# EAGLE design rotary-launcher (EAGLE 7.4.0)
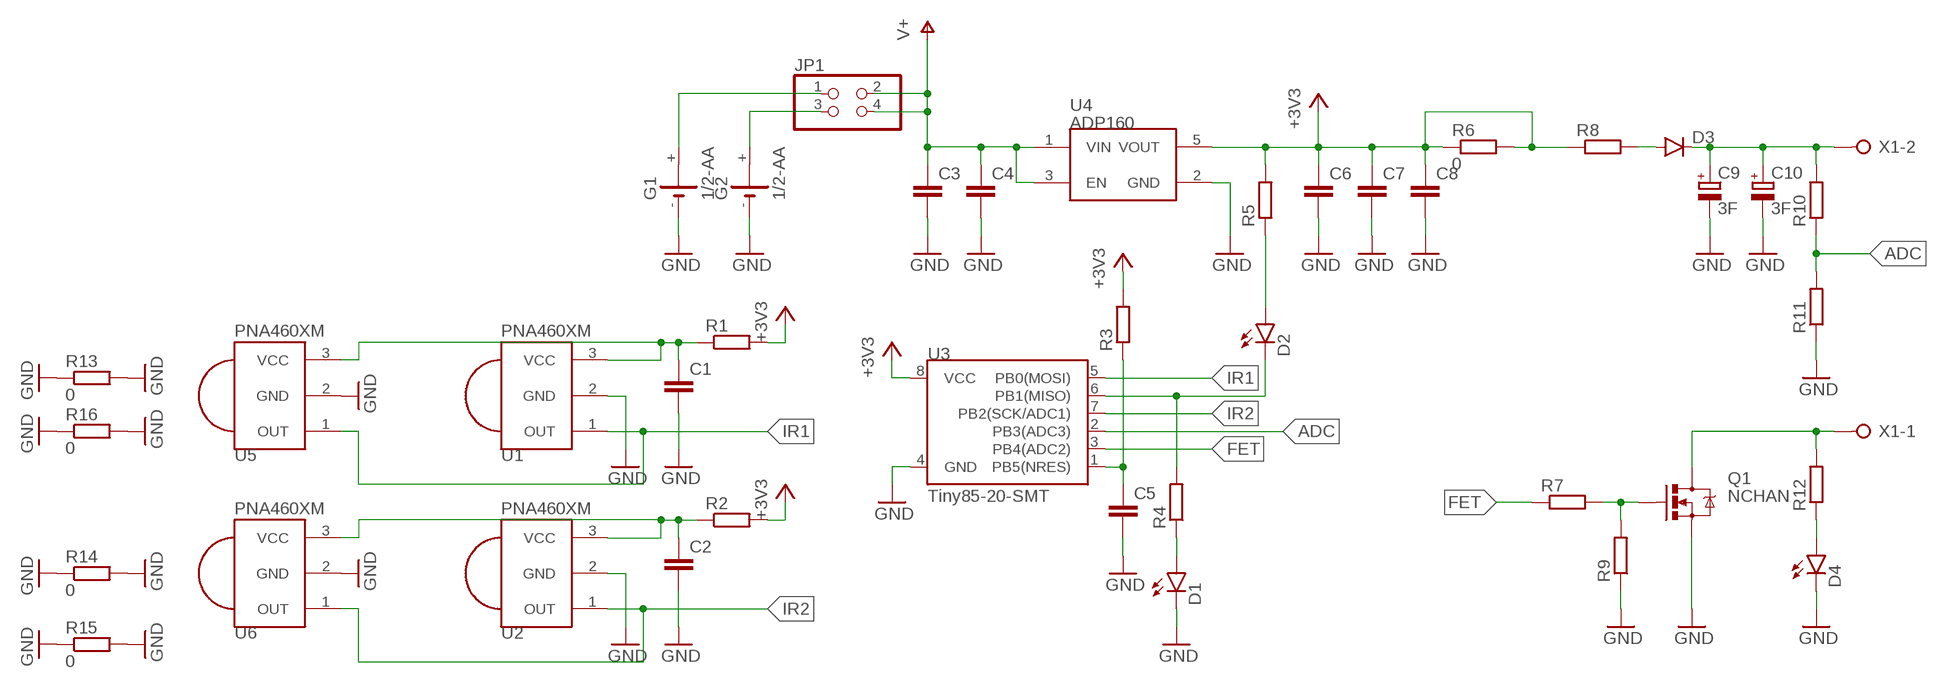
[diagram p0: schematic, sheet 1]

## Parts
C1  C-EUC0805  [C0805]
C2  C-EUC0805  [C0805]
C3  C-EUC0805  [C0805]
C4  C-EUC0805  [C0805]
C5  C-EUC0805  [C0805]
C6  C-EUC0805  [C0805]
C7  C-EUC0805  [C0805]
C8  C-EUC0805  [C0805]
C9  3F  SUPERCAPH  [E3,5-8-HOR]
C10  3F  SUPERCAPH  [E3,5-8-HOR]
D1  LED0603  [LED-0603]
D2  LED0603  [LED-0603]
D3  DIODESMB  [SMB-DIODE]
D4  LED0603  [LED-0603]
G1  1/2-AA  CR-AA  [CRAA]
G2  1/2-AA  CR-AA  [CRAA]
JP1  PINHD-2X2  [2X02]
Q1  NCHAN  MOSFET-NCHANNELAO3404A  [SOT23-3]
R1  R-EU_R0603  [R0603]
R2  R-EU_R0603  [R0603]
R3  R-EU_R0603  [R0603]
R4  R-EU_R0603  [R0603]
R5  R-EU_R0603  [R0603]
R6  0  R-EU_R1206  [R1206]
R7  R-EU_R0603  [R0603]
R8  R-EU_R1206  [R1206]
R9  R-EU_R0603  [R0603]
R10  R-EU_R0603  [R0603]
R11  R-EU_R0603  [R0603]
R12  R-EU_R0603  [R0603]
R13  0  R-EU_R1206  [R1206]
R14  0  R-EU_R1206  [R1206]
R15  0  R-EU_R1206  [R1206]
R16  0  R-EU_R1206  [R1206]
U1  PNA460XM  [PNA460XM]
U2  PNA460XM  [PNA460XM]
U3  Tiny85-20-SMT  ATTINY45TINY85-20-SMT  [SO08-EIAJ]
U4  ADP160  [SOT23-5]
U5  PNA460XM  [PNA460XM]
U6  PNA460XM  [PNA460XM]
X1  W237-02P  [W237-132]

## Nets
+3V3: C6.1 C7.1 C8.1 R1.2 R2.2 R3.2 R5.2 R6.1 R6.2 R8.1 U3.8(VCC) U4.5(VOUT)
ADC: R10.1 R11.2 U3.2(PB3(ADC3))
FET: R7.1 U3.3(PB4(ADC2))
GND: C1.2 C2.2 C3.2 C4.2 C5.2 C6.2 C7.2 C8.2 C9.- C10.- D1.C D4.C G1.- G2.- Q1.2(S) R9.1 R11.1 R13.1 R13.2 R14.1 R14.2 R15.1 R15.2 R16.1 R16.2 U1.2(GND) U2.2(GND) U3.4(GND) U4.2(GND) U5.2(GND) U6.2(GND)
IR1: U1.1(OUT) U3.5(PB0(MOSI)) U5.1(OUT)
IR2: U2.1(OUT) U3.7(PB2(SCK/ADC1)) U6.1(OUT)
N$1: D3.A R8.2
N$2: C9.+ C10.+ D3.C R10.2 X1.2
N$3: G1.+ JP1.1
N$4: G2.+ JP1.3
N$5: C1.1 R1.1 U1.3(VCC) U5.3(VCC)
N$6: Q1.1(G) R7.2 R9.2
N$7: C2.1 R2.1 U2.3(VCC) U6.3(VCC)
N$8: C5.1 R3.1 U3.1(PB5(NRES))
N$9: Q1.3(D) R12.2 X1.1
N$10: D4.A R12.1
N$11: D2.C R4.2 U3.6(PB1(MISO))
N$12: D2.A R5.1
N$15: D1.A R4.1
V+: C3.1 C4.1 JP1.2 JP1.4 U4.1(VIN) U4.3(EN)

## Library data of the parts
C1-C8 = rcl:C-EU: CAPACITOR, European symbol
C9 C10 = rotary-launcher:SUPERCAP
D1 D2 D4 = SparkFun-LED:LED: LEDs Standard schematic elements and footprints for 5mm, 3mm, 1206, and 0603 sized LEDs. 5mm - Spark Fun Electronics SKU : COM-00529 (and others)
D3 = SparkFun-DiscreteSemi:DIODE: Diode These are standard reverse protection diodes and small signal diodes. SMA package can handle up to about 1A. SOD-323 can handle about 200mA. What the SOD-323 package when ordering, there are some mfgs out there that are 5-pin packages.; PROD_ID: DIO-09646
G1 G2 = rotary-launcher:CR-AA: LI BATTERY Varta CRAA-SLF
JP1 = pinhead:PINHD-2X2: PIN HEADER
Q1 = SparkFun-DiscreteSemi:MOSFET-NCHANNEL: Common NMOSFET Parts MFG P/N Store ID Prod ID FDD8780 TRANS-09984 SI7820DN TRANS-11055 FDS6630A IC-08089 2N7002PW TRANS-11151 FQP30N06L COM-10213 TRANS-10060 BSS123LT1G TRANS-08345 BSS138 TRANS-00830 BS170 2N7000; PROD_ID: TRAN-12988
R1-R16 = rcl:R-EU_: RESISTOR, European symbol
U1 U2 U5 U6 = rotary-launcher:PNA460XM: IR 38KHz receiver PNA4602 and related receivers http://www.ladyada.net/library/pcb/eaglelibrary.html
U3 = SparkFun-DigitalIC:ATTINY45: Atmel 8-pin 2/4/8kB flash uC; PROD_ID: IC-09092
U4 = SparkFun-PowerIC:ADP160: Nanopower LDO Iq less than 1uA for low Iload; PROD_ID: VREG-11306
X1 = con-wago-508:W237-02P: WAGO SREW CLAMP; OC_FARNELL: unknown; OC_NEWARK: unknown

## Board
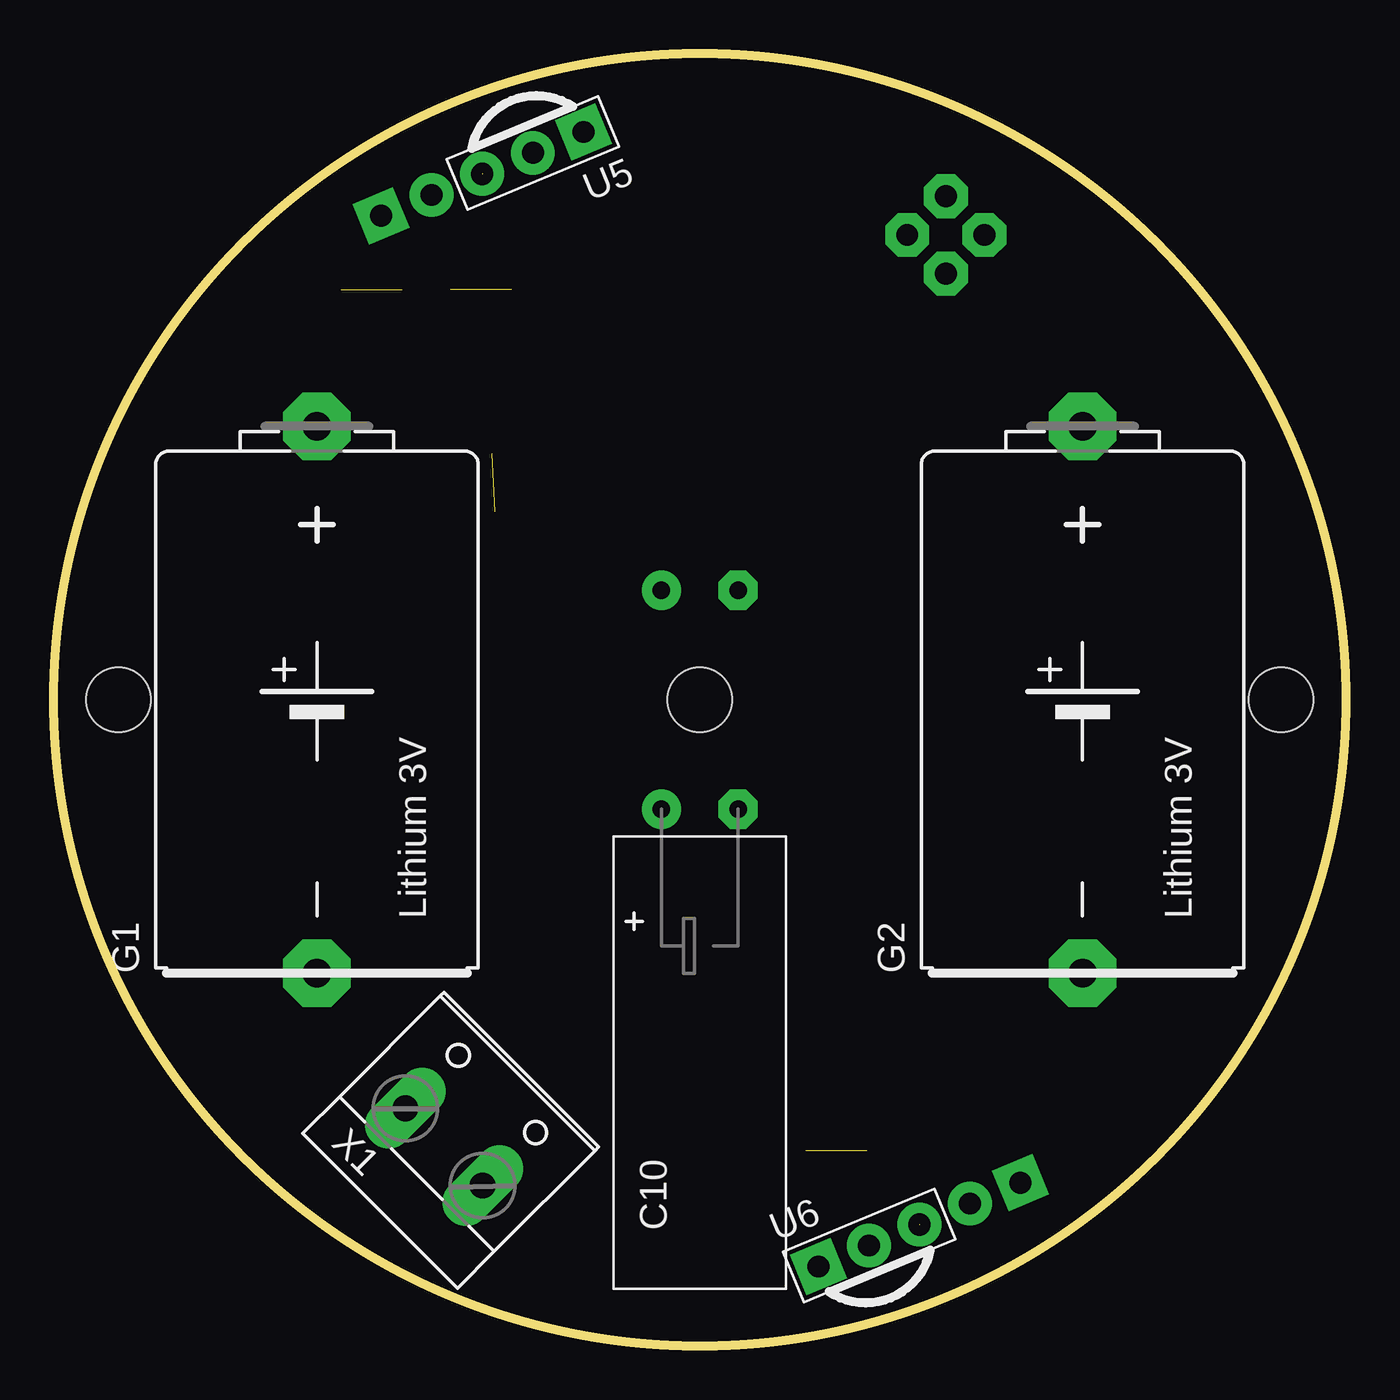
[diagram p1: board, top side]
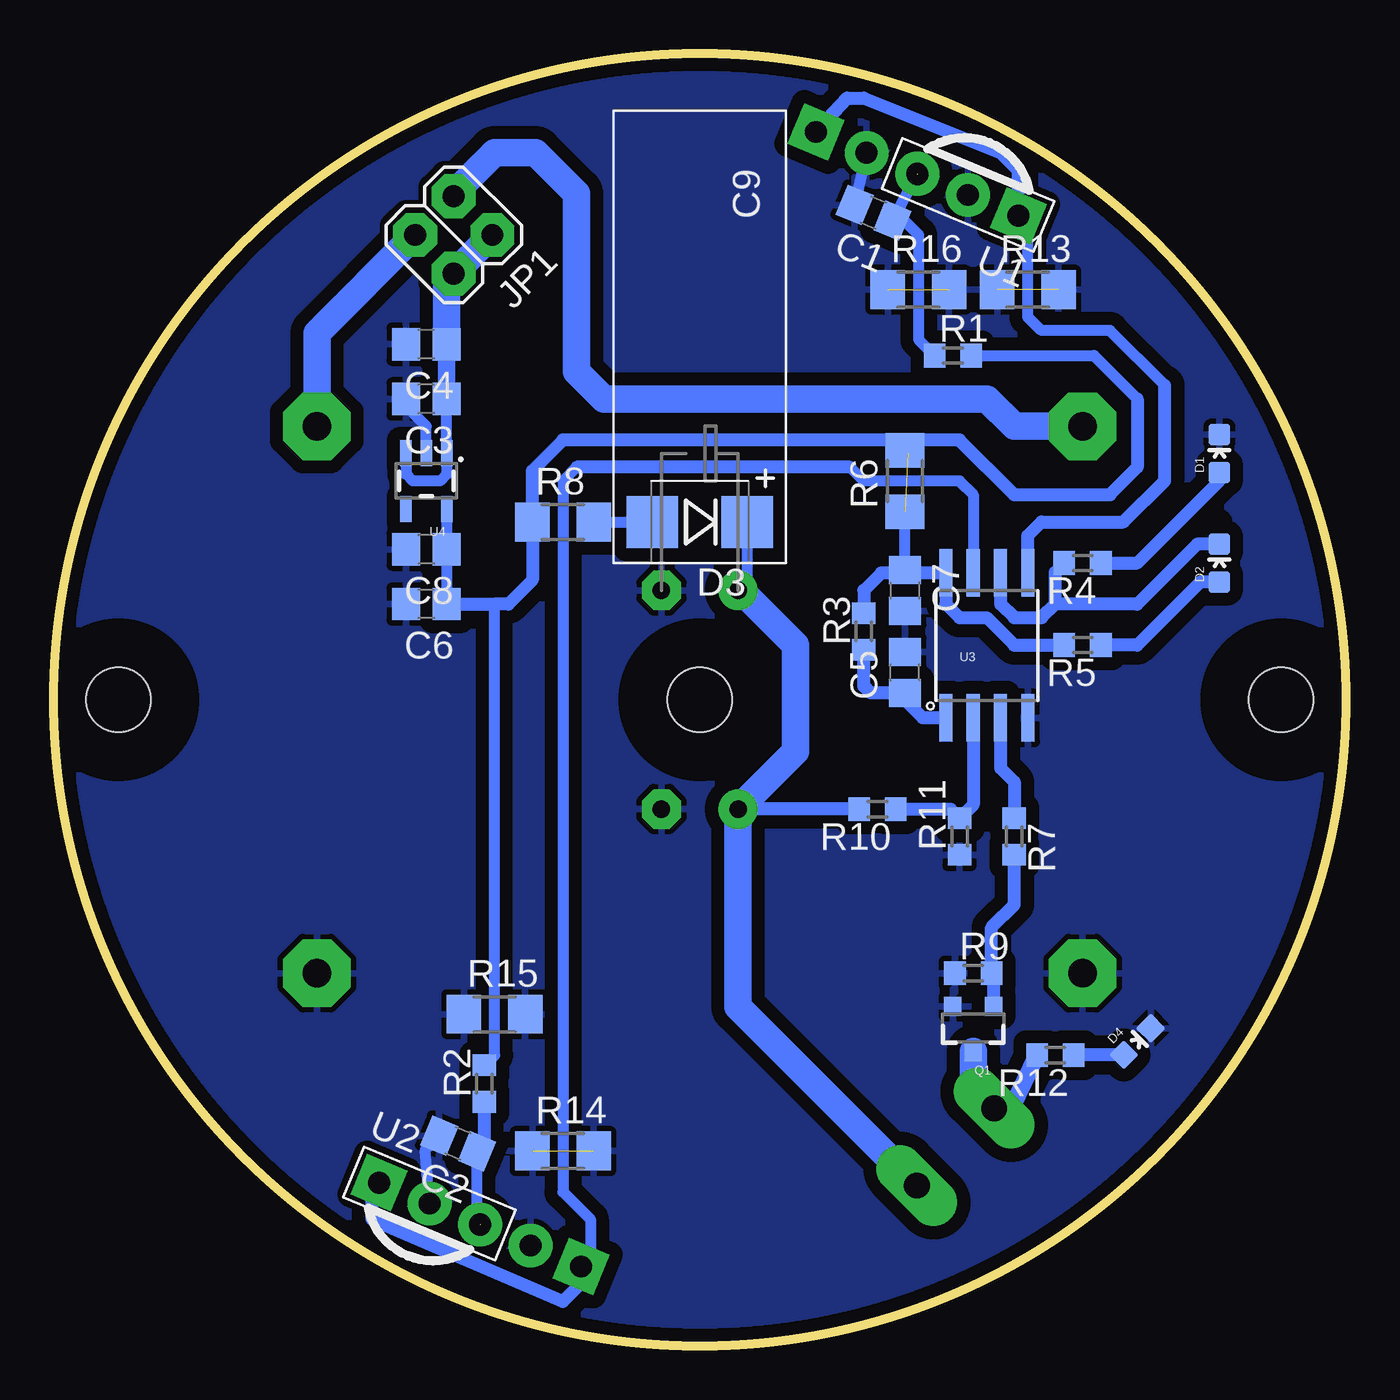
[diagram p2: board, bottom side, seen from below]

Size 60 x 60 mm. Coordinates in mm from the lower left corner, seen from the top.
Outline: circle at 30,30 radius 30
Copper layers (1*16): Top 0.035mm / dielectric 1.5mm / Bottom 0.035mm
Design rules "default *": minimum track width 10mil, minimum drill 24mil, track to track 8mil, track to pad 8mil, pad to pad 8mil, via to via 8mil, smd to smd 8mil, copper to edge 20mil, drill to drill 8mil, minimum pad ring 20mil, minimum via ring 8mil, stop-mask expansion 4mil, vias tented up to drill 0mil, thermal gap 10mil
Holes 3 mm at 57,30 3,30 30,30
bRestrict: area 27,27 to 33,33; area 28.7,37 to 31.3,37.6; area 54,27 to 60,33; area 0,27 to 6,33; area 5.9,36.4 to 6.5,38.3

### Footprints (pad centres in the part's own frame; a part is rotated, then mirrored left to right if it is on the bottom)
C0805 = smd 1.3 x 1.5: 1 -0.95,0; 2 0.95,0
E3,5-8-HOR = drill 0.813 pad 1.6: + -1.778,0 | drill 0.813 pad 1.6 octagon: - 1.778,0
LED-0603 = smd 1 x 1: A 0,-0.877; C 0,0.877
SMB-DIODE = smd 2.4 x 2.4: A 2.2,0; C -2.2,0
CRAA = drill 1.321 pad 3.15 octagon: + 12.7,0; - -12.7,0
2X02 = drill 1.016 octagon: 1 -1.27,-1.27; 2 -1.27,1.27; 3 1.27,-1.27; 4 1.27,1.27
SOT23-3 = smd 0.8 x 0.9: 1 -0.95,-1; 2 0.95,-1; 3 0,1.1
R0603 = smd 1 x 1.1: 1 -0.85,0; 2 0.85,0
R1206 = smd 1.6 x 1.803: 1 -1.422,0; 2 1.422,0
PNA460XM = drill 1.016 pad 1.93 square: 1 -2.54,0 | drill 1.016 pad 1.93: 2 0,0; 3 2.54,0
SO08-EIAJ = smd 0.61 x 2.21: 1 -1.905,-3.378; 2 -0.635,-3.378; 3 0.635,-3.378; 4 1.905,-3.378; 5 1.905,3.353; 6 0.635,3.353; 7 -0.635,3.353; 8 -1.905,3.353
SOT23-5 = smd 0.55 x 1.2: 1 -0.95,-1.3; 2 0,-1.3; 3 0.95,-1.3; 4 0.95,1.3; 5 -0.95,1.3
W237-132 = drill 1.194 long: 1 -2.54,-0.635; 2 2.54,-0.635

### Placement (x,y rotation side)
C1  21.93,52.62 157.5 bottom
C2  41.22,9.39 157.5 bottom
C3  42.7,43.97 180 bottom
C4  42.7,46.51 180 bottom
C5  20.48,31.27 90 bottom
C6  42.7,34.45 180 bottom
C7  20.48,35.08 270 bottom
C8  42.7,36.98 180 bottom
C9  30,35.08 180 bottom
C10  30,24.92 0 top
D1  5.87,41.43 0 bottom
D2  5.87,36.35 0 bottom
D3  30,38.26 180 bottom
D4  9.68,14.12 315 bottom
G1  12.22,30 90 top
G2  47.78,30 90 top
JP1  41.43,51.59 225 bottom
Q1  17.3,14.76 180 bottom
R1  18.24,45.98 0 bottom
R2  40.01,12.17 90 bottom
R3  22.38,33.17 90 bottom
R4  12.22,36.35 180 bottom
R5  12.22,32.54 180 bottom
R6  20.48,40.16 90 bottom
R7  15.39,23.65 270 bottom
R8  36.35,38.26 0 bottom
R9  17.3,17.3 0 bottom
R10  21.74,24.92 180 bottom
R11  17.94,23.65 90 bottom
R12  13.49,13.49 180 bottom
R13  14.76,49.05 0 bottom
R14  36.35,9.05 0 bottom
R15  39.52,15.39 0 bottom
R16  19.84,49.05 0 bottom
U1  17.54,53.45 157.5 bottom
U2  42.55,6.6 337.5 bottom
U3  16.66,32.54 0 bottom
U4  42.7,40.16 180 bottom
U5  22.25,55.4 202.5 top
U6  37.86,4.65 22.5 top
X1  18.57,9.68 315 top

### Tracks (layer width: path | path; a pad name or v marks a point on that pad's centre or on a via)
+3V3  (1 unrouted)
  Bottom 0.5: 20.44,35.89 C7.1 R6.1 | U4.5 C8.1 C6.1 | 9.68,43.97 11.69,45.98 R1.2 | R2.2 39.99,13.02 39.52,13.49 39.52,34.45 | 20.32,41.43 R6.2
  Bottom 0.61: C6.1 39.52,34.45 38.89,34.45 37.77,35.56 R8.1 37.77,40.64 36.35,42.06 20.96,42.06 R6.2 19.99,42.06 17.94,42.06 15.39,39.52 10.95,39.52 9.68,40.8 9.68,43.97 | R5.2 15.39,32.54 16.66,33.81 17.94,33.81 18.57,34.45 U3.8 20.44,35.89 21.57,35.89 22.38,35.08 R3.2
AAA
  pour Bottom (isolate 0.01): 45.88,34.45 45.88,25.55 50.32,25.55 50.32,34.45
ADC
  Bottom 0.61: U3.2 17.3,25.13 R11.2 18.36,24.92 R10.1
FET
  Bottom 0.61: U3.3 16.03,26.82 15.39,26.19 R7.1
GND  (3 unrouted)
  Bottom 0.5: U4.2 42.7,42.7 43.34,43.34 43.34,43.66 C3.2 | U5.2 C1.2 | U2.2 42.75,9.1 C2.2
  pour Bottom (isolate 0.61): -0.48,16.03 -0.48,42.7 17.3,60.48 41.43,60.48 60.48,43.97 60.48,17.3 42.7,-0.48 18.57,-0.48
IR1
  Bottom 0.5: 8.41,44.61 10.95,47.14 14.12,47.14 14.76,47.78 14.76,52.04 U1.1
  Bottom 0.61: U1.1 15.2,54.57 16.03,55.4 22.38,57.94 23.16,57.94 U5.1 | U3.5 14.76,37.62 14.12,38.26 10.32,38.26 8.41,40.16 8.41,44.61
IR2
  Bottom 0.5: 35.52,2.89 U6.1 35.08,4.11 35.08,5.87 36.35,7.14 36.35,40.16 35.72,40.8 | U2.1 45.24,7.57 | U3.7 17.3,39.52 17.94,40.16 22.38,40.16 23.02,40.8
  Bottom 0.61: 35.52,2.89 36.35,2.06 45.24,5.87 45.24,7.57 | 23.02,40.8 35.72,40.8
N$1
  Bottom 0.5: R8.2 D3.A
N$2
  Bottom 0.5: D3.C 27.8,35.5 C9.+
  Bottom 0.61: R10.2 C10.+
  Bottom 0.813: C10.+ 28.22,25.43
  Bottom 1.016: C9.+ 28.09,35.08
  Bottom 1.27: X1.2 28.22,15.74 C10.+ 25.55,27.59 25.55,32.54 28.09,35.08
N$3
  Bottom 1.27: G1.+ 15.39,42.7 16.66,43.97 34.45,43.97 35.72,45.24 35.72,53.5 37.62,55.4 39.52,55.4 41.43,53.5 JP1.1
N$4
  Bottom 1.27: G2.+ 47.78,47.04 JP1.3
N$5  (1 unrouted)
  Bottom 0.5: U5.3 C1.1 20.5,52.25 19.84,51.59 19.84,46.73 R1.1
N$6
  Bottom 0.61: Q1.1 16.35,17.2 | R9.2 16.45,19.42 15.39,20.48 R7.2
  Bottom 0.813: 16.35,17.2 R9.2
N$7  (1 unrouted)
  Bottom 0.5: U2.3 40.34,5.83 C2.1
  Bottom 0.61: R2.1 40.01,9.36 C2.1
N$8
  Bottom 0.5: 20.48,30 C5.1
  Bottom 0.61: U3.1 19.64,29.16 20.48,30 | C5.1 22.07,30.32 22.38,30.64 R3.1
N$9
  Bottom 0.61: X1.1 15.53,11.03
  Bottom 0.813: 15.53,11.03 R12.2 | 17.3,12 X1.1
  Bottom 1.27: Q1.3 17.3,12
N$10
  Bottom 0.61: D4.A 12.62,13.5 R12.1
N$11
  Bottom 0.5: 13.49,35.93 R4.2
  Bottom 0.61: U3.6 16.03,34.45 15.39,33.81 14.12,33.81 13.49,34.45 | 13.49,34.45 13.49,35.93 | 13.49,34.45 9.68,34.45 6.9,37.23 D2.C
N$12
  Bottom 0.61: R5.1 9.68,32.54 6.75,35.47 D2.A
N$15
  Bottom 0.61: R4.1 9.68,36.35 5.87,40.16 D1.A
V+
  Bottom 0.5: 41.75,49.47 JP1.4 | C3.1 U4.1 41.75,40.48 42.06,40.16 43.34,40.16 43.65,40.48 U4.3
  Bottom 0.813: C3.1 C4.1 | JP1.2
  Bottom 1.27: JP1.2 JP1.4 | C4.1 41.75,49.47

### Text on the board
bRestrict: 2017